# EAGLE schematic jr-support (EAGLE 8.1.0)
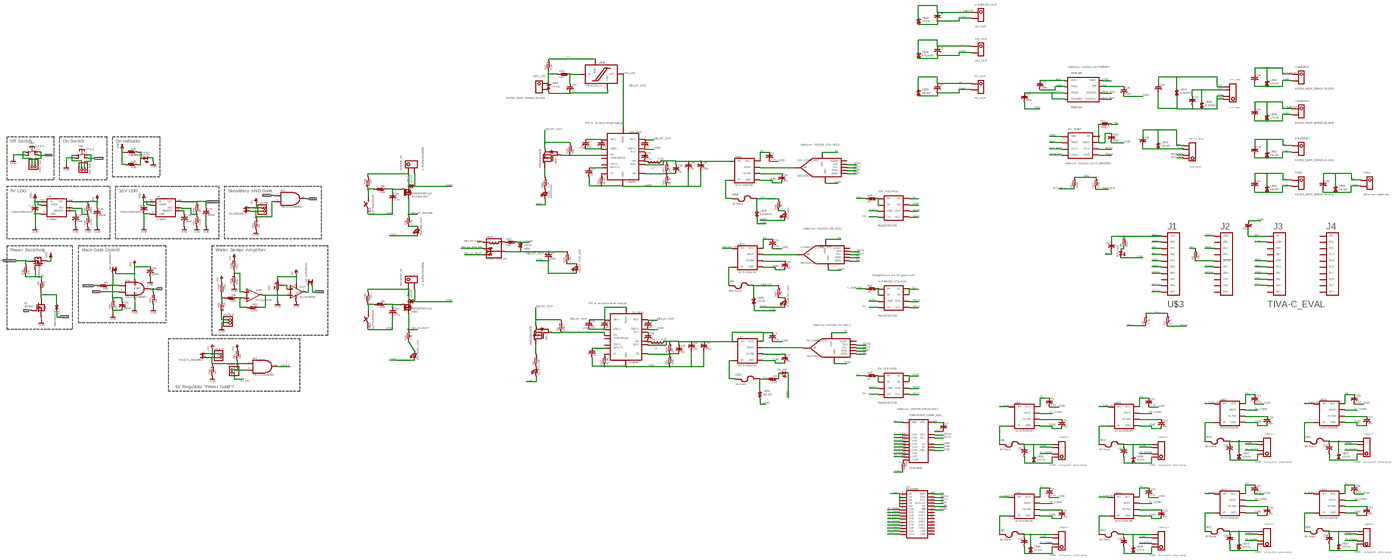
[diagram p0: schematic, sheet 1, overview]
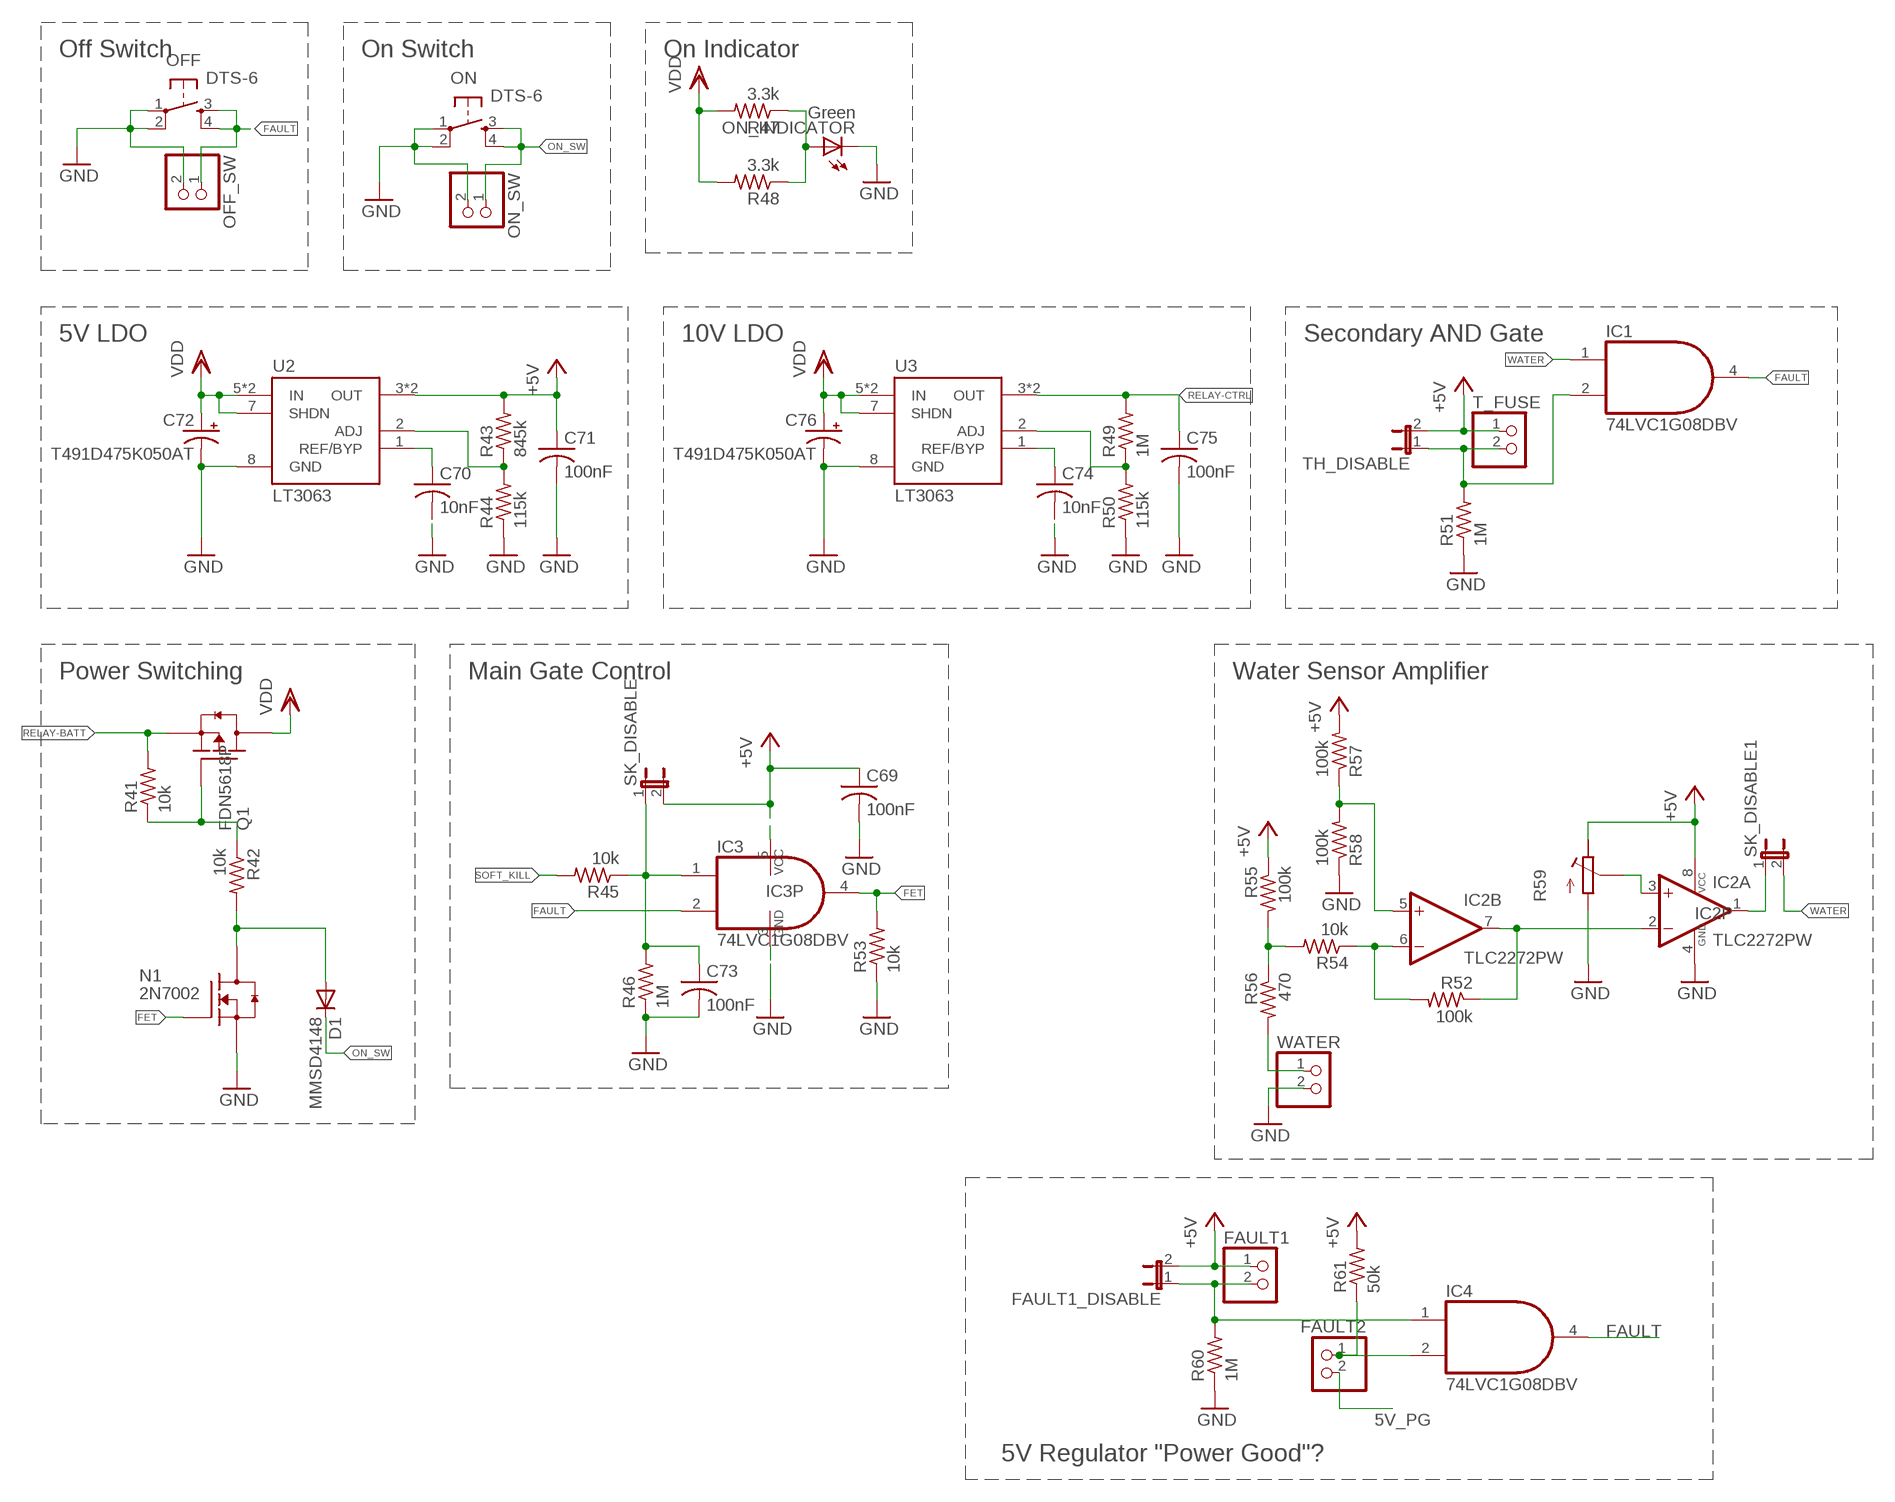
[diagram p1: schematic, sheet 1, part 1 of 4]
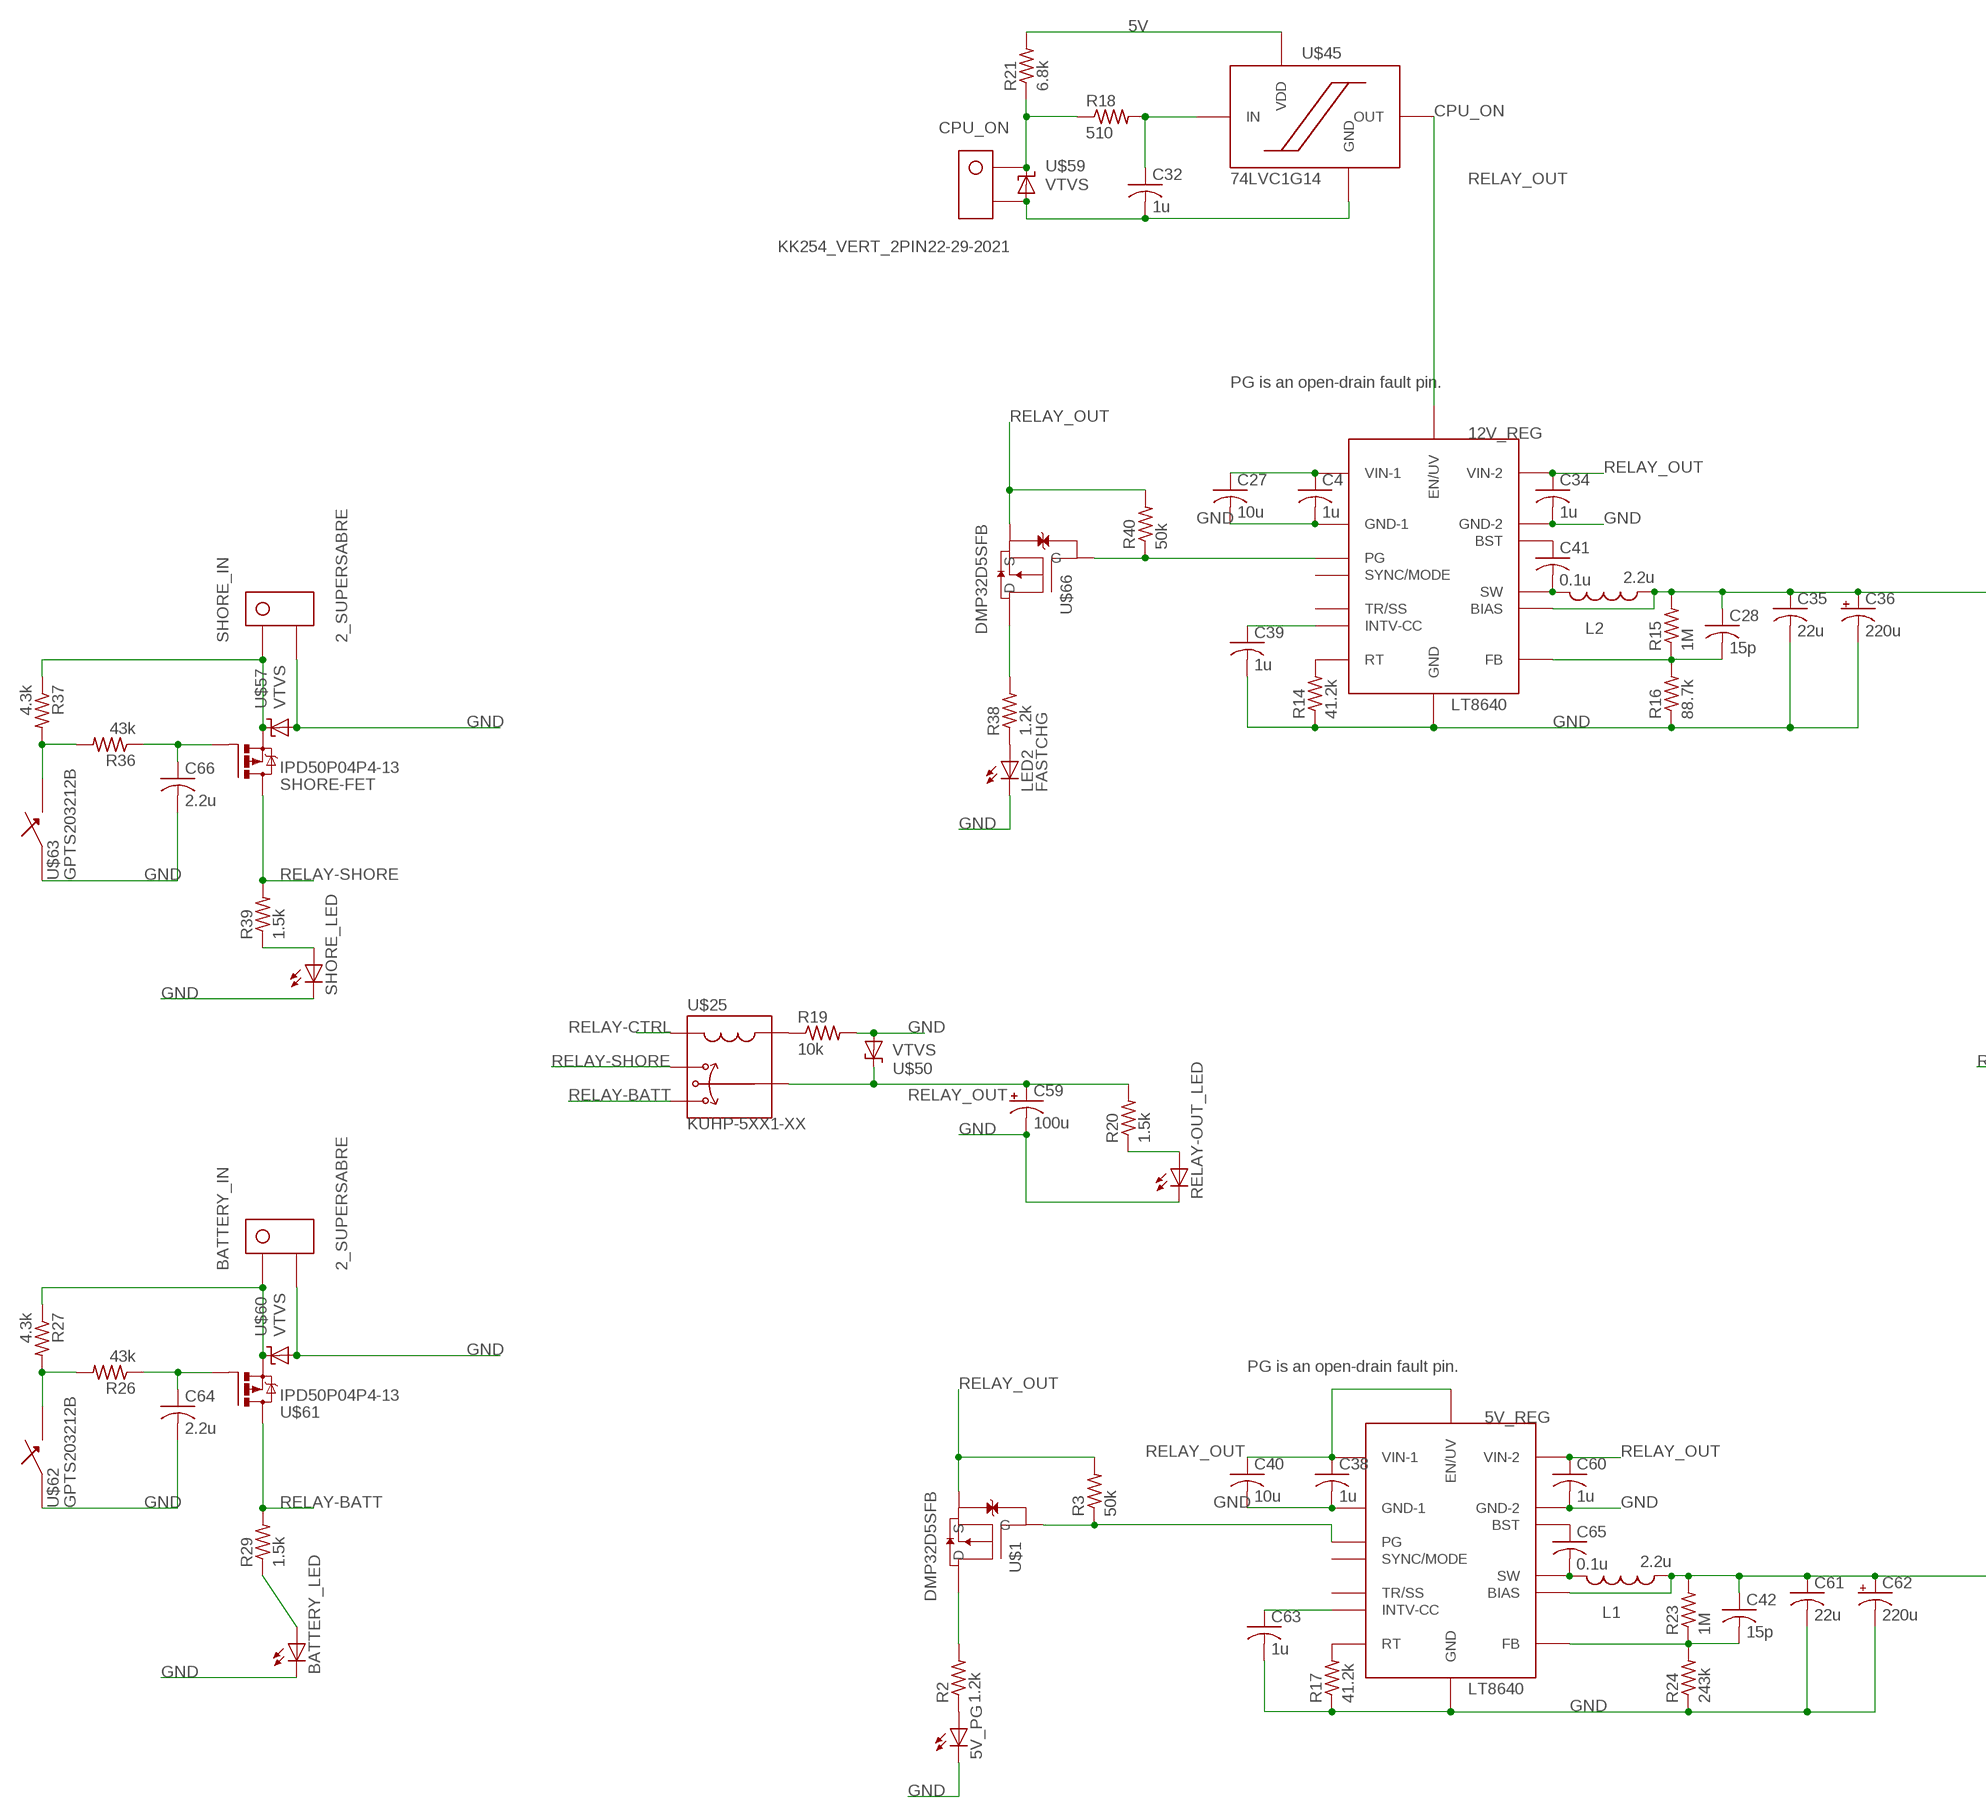
[diagram p2: schematic, sheet 1, part 2 of 4]
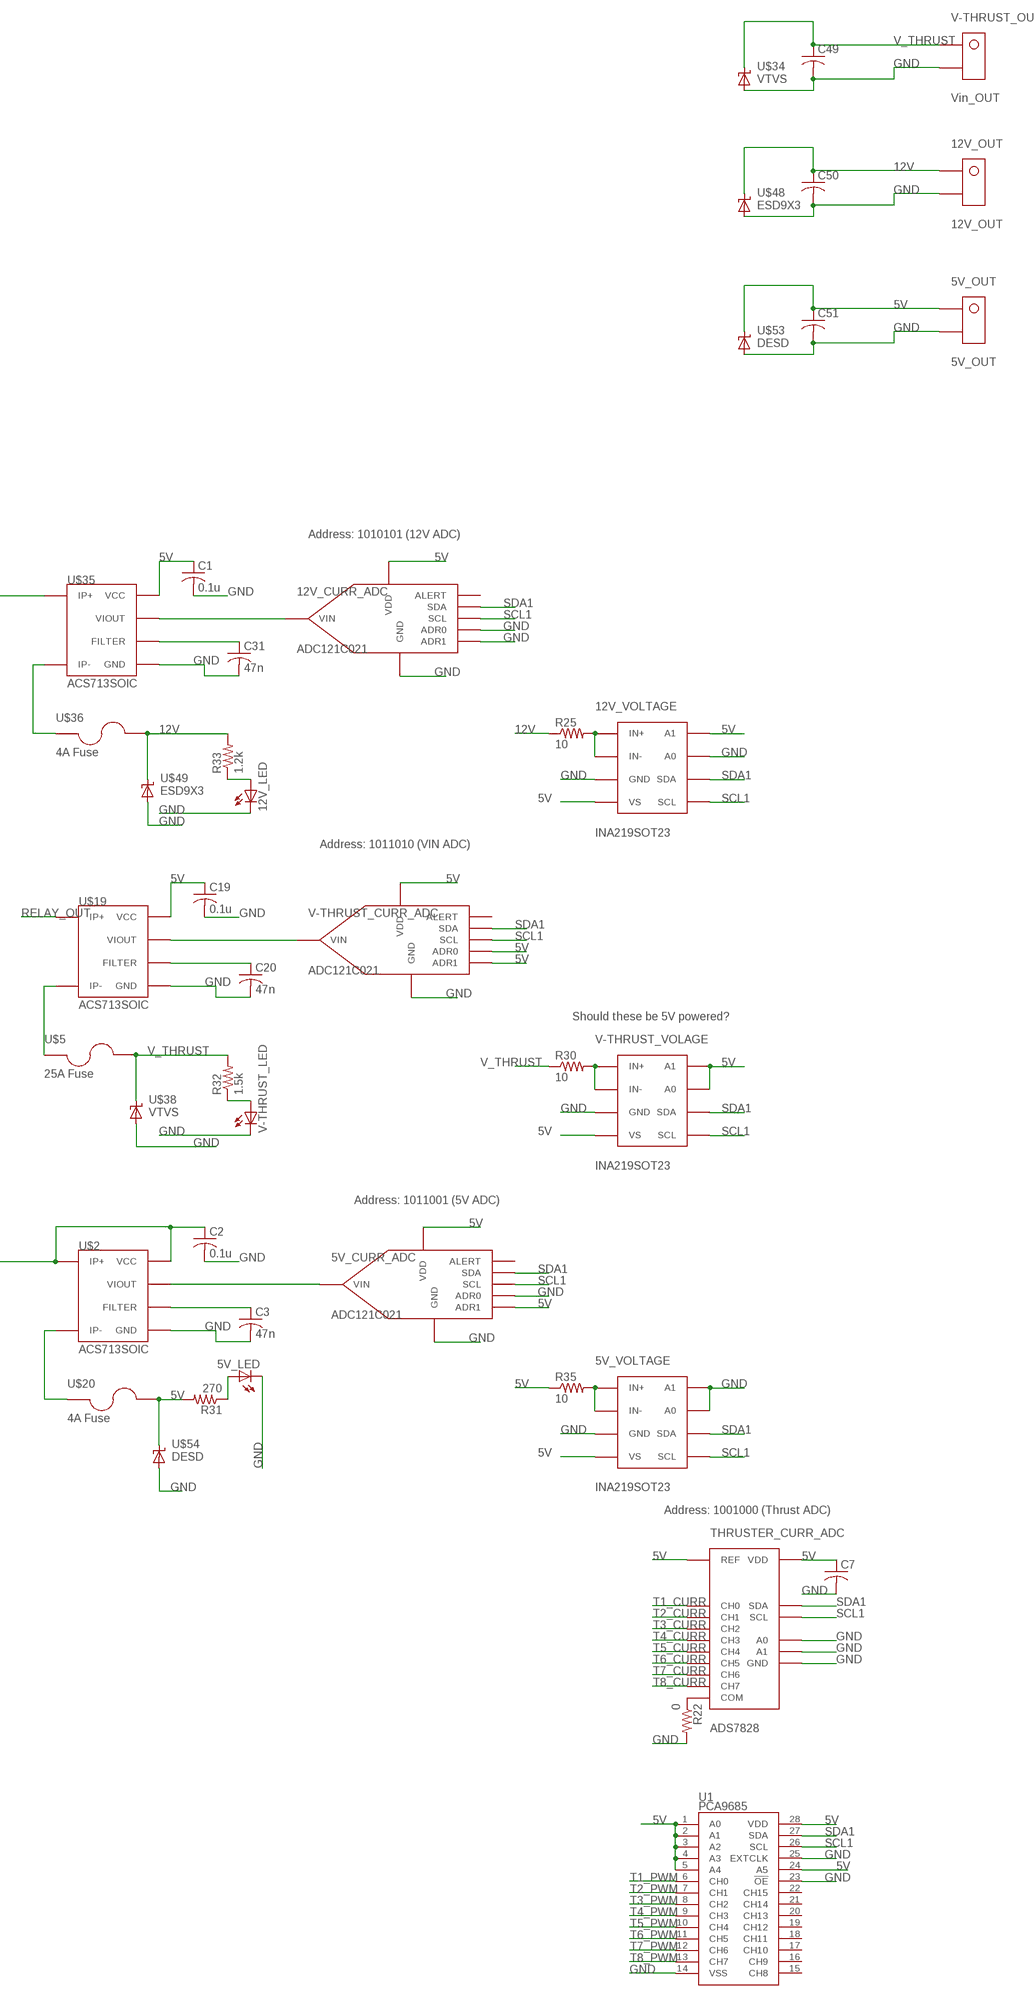
[diagram p3: schematic, sheet 1, part 3 of 4]
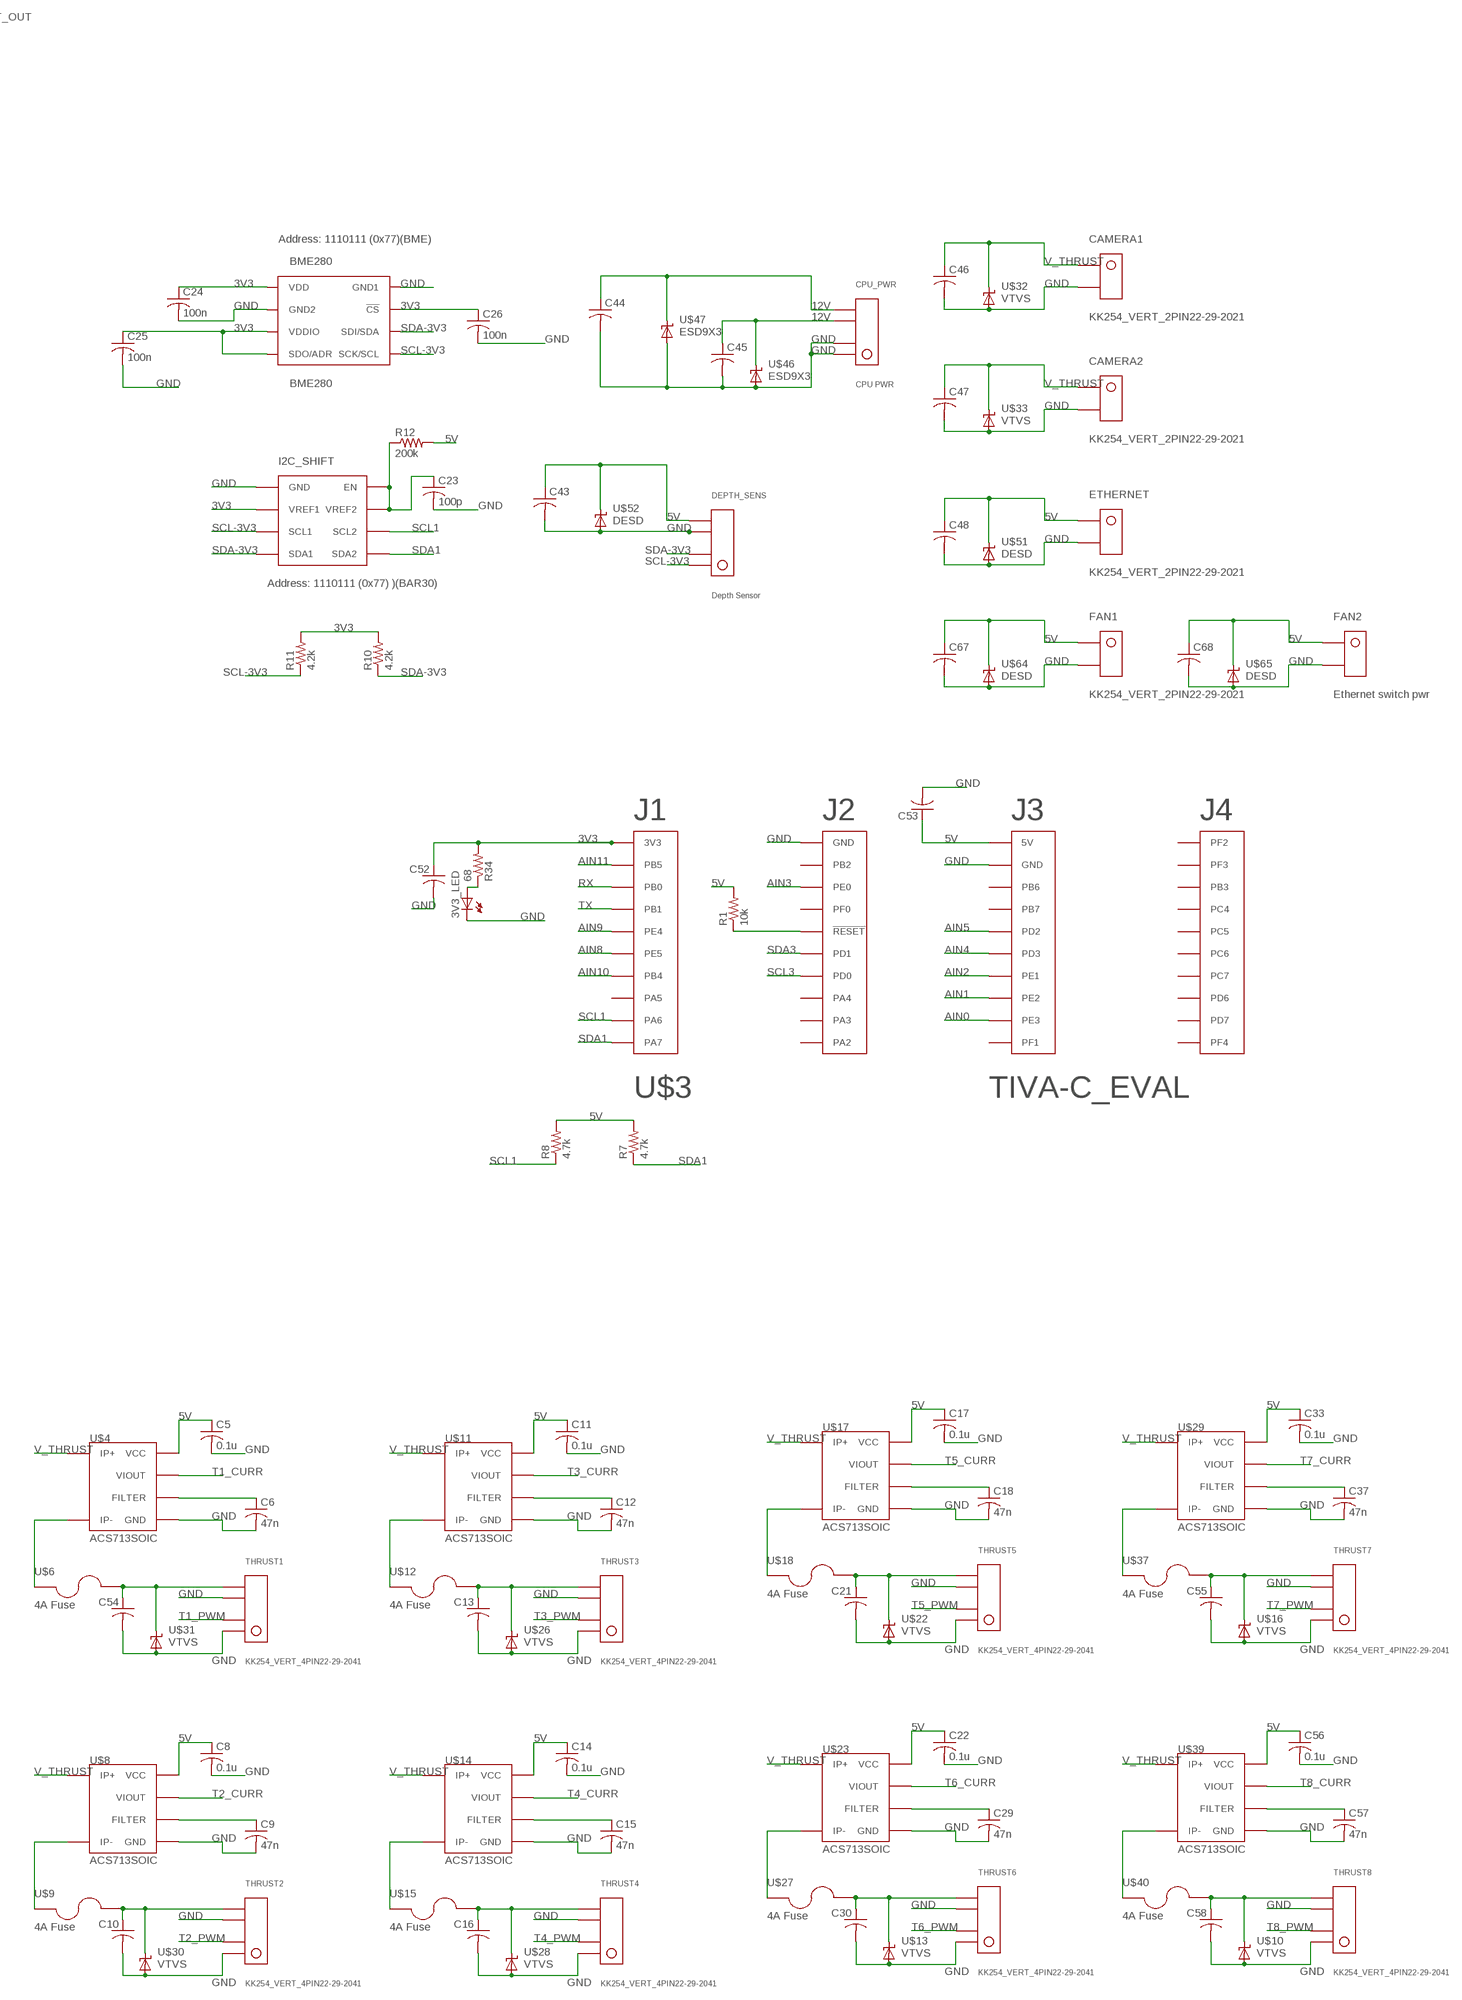
[diagram p4: schematic, sheet 1, part 4 of 4]

## Parts
3V3_LED  0805_LED  [0805]
5V_CURR_ADC  ADC121C021  [VSSOP-8]
5V_LED  0805_LED  [0805]
5V_OUT  5V_OUT  KK254_VERT_2PIN22-29-2021  [KK254_VERT_2PIN]
5V_PG  LEDCHIP-LED0805  [CHIP-LED0805]
5V_REG  LT8640  [QFN18-3X4]
5V_VOLTAGE  INA219SOT23  [SOT-23-8]
12V_CURR_ADC  ADC121C021  [VSSOP-8]
12V_LED  0805_LED  [0805]
12V_OUT  12V_OUT  KK254_VERT_2PIN22-29-2021  [KK254_VERT_2PIN]
12V_REG  LT8640  [QFN18-3X4]
12V_VOLTAGE  INA219SOT23  [SOT-23-8]
BATTERY_IN  2_SUPERSABRE  [SUPERSABRE_2CIRCUIT]
BATTERY_LED  0805_LED  [0805]
BME280  BME280  [BME280_LGA]
C1  0.1u  C-USC0805  [C0805]
C2  0.1u  C-USC0805  [C0805]
C3  47n  C-USC0805  [C0805]
C4  1u  C-USC0805  [C0805]
C5  0.1u  C-USC0805  [C0805]
C6  47n  C-USC0805  [C0805]
C7  C-USC0805  [C0805]
C8  0.1u  C-USC0805  [C0805]
C9  47n  C-USC0805  [C0805]
C10  C-USC0805  [C0805]
C11  0.1u  C-USC0805  [C0805]
C12  47n  C-USC0805  [C0805]
C13  C-USC0805  [C0805]
C14  0.1u  C-USC0805  [C0805]
C15  47n  C-USC0805  [C0805]
C16  C-USC0805  [C0805]
C17  0.1u  C-USC0805  [C0805]
C18  47n  C-USC0805  [C0805]
C19  0.1u  C-USC0805  [C0805]
C20  47n  C-USC0805  [C0805]
C21  C-USC0805  [C0805]
C22  0.1u  C-USC0805  [C0805]
C23  100p  C-USC0805  [C0805]
C24  100n  C-USC0805  [C0805]
C25  100n  C-USC0805  [C0805]
C26  100n  C-USC0805  [C0805]
C27  10u  C-USC0805  [C0805]
C28  15p  C-USC0805  [C0805]
C29  47n  C-USC0805  [C0805]
C30  C-USC0805  [C0805]
C31  47n  C-USC0805  [C0805]
C32  1u  C-USC0805  [C0805]
C33  0.1u  C-USC0805  [C0805]
C34  1u  C-USC0805  [C0805]
C35  22u  C-USC0805  [C0805]
C36  220u  CPOL-USC-F80  [C-F80]
C37  47n  C-USC0805  [C0805]
C38  1u  C-USC0805  [C0805]
C39  1u  C-USC0805  [C0805]
C40  10u  C-USC0805  [C0805]
C41  0.1u  C-USC0805  [C0805]
C42  15p  C-USC0805  [C0805]
C43  C-USC0805  [C0805]
C44  C-USC0805  [C0805]
C45  C-USC0805  [C0805]
C46  C-USC0805  [C0805]
C47  C-USC0805  [C0805]
C48  C-USC0805  [C0805]
C49  C-USC0805  [C0805]
C50  C-USC0805  [C0805]
C51  C-USC0805  [C0805]
C52  C-USC0805  [C0805]
C53  C-USC0805  [C0805]
C54  C-USC0805  [C0805]
C55  C-USC0805  [C0805]
C56  0.1u  C-USC0805  [C0805]
C57  47n  C-USC0805  [C0805]
C58  C-USC0805  [C0805]
C59  100u  CPOL-USE3.5-8  [E3,5-8]
C60  1u  C-USC0805  [C0805]
C61  22u  C-USC0805  [C0805]
C62  220u  CPOL-USC-F80  [C-F80]
C63  1u  C-USC0805  [C0805]
C64  2.2u  C-USC0805  [C0805]
C65  0.1u  C-USC0805  [C0805]
C66  2.2u  C-USC0805  [C0805]
C67  C-USC0805  [C0805]
C68  C-USC0805  [C0805]
C69  100nF  C-USC0805  [C0805]
C70  10nF  C-USC0805  [C0805]
C71  100nF  C-USC0805  [C0805]
C72  T491D475K050AT  CPOL-USCT7343  [CT7343]
C73  100nF  C-USC0805  [C0805]
C74  10nF  C-USC0805  [C0805]
C75  100nF  C-USC0805  [C0805]
C76  T491D475K050AT  CPOL-USCT7343  [CT7343]
CAMERA1  KK254_VERT_2PIN22-29-2021  [KK254_VERT_2PIN]
CAMERA2  KK254_VERT_2PIN22-29-2021  [KK254_VERT_2PIN]
CPU_ON  KK254_VERT_2PIN22-29-2021  [KK254_VERT_2PIN]
CPU_PWR  CPU PWR  KK254_VERT_4PIN22-29-2041  [KK254_VERT_4PIN]
D1  MMSD4148  DIODE-SOD123  [SOD123]
DEPTH_SENS  Depth Sensor  KK254_VERT_4PIN22-29-2041  [KK254_VERT_4PIN]
ETHERNET  KK254_VERT_2PIN22-29-2021  [KK254_VERT_2PIN]
FAN1  KK254_VERT_2PIN22-29-2021  [KK254_VERT_2PIN]
FAN2  Ethernet switch pwr  KK254_VERT_2PIN22-29-2021  [KK254_VERT_2PIN]
FAULT1  PINHD-1X2  [1X02]
FAULT1_DISABLE  JP1E  [JP1]
FAULT2  PINHD-1X2  [1X02]
I2C_SHIFT  PCA9306DCT  [SM8]
IC1  74LVC1G08DBV  [SOT23-5]
IC2  TLC2272PW  [TSSOP8]
IC3  74LVC1G08DBV  [SOT23-5]
IC4  74LVC1G08DBV  [SOT23-5]
L1  2.2u  L-USL0740  [L0740]
L2  2.2u  L-USL0740  [L0740]
LED2  FASTCHG  LEDCHIP-LED0805  [CHIP-LED0805]
N1  2N7002  [SOT23]
OFF  DTS-6  [DTS-6]
OFF_SW  PINHD-1X2  [1X02]
ON  DTS-6  [DTS-6]
ON_INDICATOR  Green  LEDCHIP-LED0805  [CHIP-LED0805]
ON_SW  PINHD-1X2  [1X02]
Q1  FDN5618P  [SOT23]
R1  10k  R-US_R0805  [R0805]
R2  1.2k  R-US_R0805  [R0805]
R3  50k  R-US_R0805  [R0805]
R7  4.7k  R-US_R0805  [R0805]
R8  4.7k  R-US_R0805  [R0805]
R10  4.2k  R-US_R0805  [R0805]
R11  4.2k  R-US_R0805  [R0805]
R12  200k  R-US_R0805  [R0805]
R14  41.2k  R-US_R0805  [R0805]
R15  1M  R-US_R0805  [R0805]
R16  88.7k  R-US_R0805  [R0805]
R17  41.2k  R-US_R0805  [R0805]
R18  510  R-US_R0805  [R0805]
R19  10k  R-US_R0805  [R0805]
R20  1.5k  R-US_R0805  [R0805]
R21  6.8k  R-US_R0805  [R0805]
R22  0  R-US_R0805  [R0805]
R23  1M  R-US_R0805  [R0805]
R24  243k  R-US_R0805  [R0805]
R25  10  R-US_R0805  [R0805]
R26  43k  R-US_R0805  [R0805]
R27  4.3k  R-US_R0805  [R0805]
R29  1.5k  R-US_R0805  [R0805]
R30  10  R-US_R0805  [R0805]
R31  270  R-US_R0805  [R0805]
R32  1.5k  R-US_R0805  [R0805]
R33  1.2k  R-US_R0805  [R0805]
R34  68  R-US_R0805  [R0805]
R35  10  R-US_R0805  [R0805]
R36  43k  R-US_R0805  [R0805]
R37  4.3k  R-US_R0805  [R0805]
R38  1.2k  R-US_R0805  [R0805]
R39  1.5k  R-US_R0805  [R0805]
R40  50k  R-US_R0805  [R0805]
R41  10k  R-US_R0805  [R0805]
R42  10k  R-US_R0805  [R0805]
R43  845k  R-US_R0805  [R0805]
R44  115k  R-US_R0805  [R0805]
R45  10k  R-US_R0805  [R0805]
R46  1M  R-US_R0805  [R0805]
R47  3.3k  R-US_R0805  [R0805]
R48  3.3k  R-US_R0805  [R0805]
R49  1M  R-US_R0805  [R0805]
R50  115k  R-US_R0805  [R0805]
R51  1M  R-US_R0805  [R0805]
R52  100k  R-US_R0805  [R0805]
R53  10k  R-US_R0805  [R0805]
R54  10k  R-US_R0805  [R0805]
R55  100k  R-US_R0805  [R0805]
R56  470  R-US_R0805  [R0805]
R57  100k  R-US_R0805  [R0805]
R58  100k  R-US_R0805  [R0805]
R59  R-TRIMM3314J  [RTRIM3314J]
R60  1M  R-US_R0805  [R0805]
R61  50k  R-US_R0805  [R0805]
RELAY-OUT_LED  0805_LED  [0805]
SHORE-FET  IPD50P04P4-13  [TO252-3]
SHORE_IN  2_SUPERSABRE  [SUPERSABRE_2CIRCUIT]
SHORE_LED  0805_LED  [0805]
SK_DISABLE  JP1E  [JP1]
SK_DISABLE1  JP1E  [JP1]
T_FUSE  PINHD-1X2  [1X02]
TH_DISABLE  JP1E  [JP1]
THRUST1  KK254_VERT_4PIN22-29-2041  [KK254_VERT_4PIN]
THRUST2  KK254_VERT_4PIN22-29-2041  [KK254_VERT_4PIN]
THRUST3  KK254_VERT_4PIN22-29-2041  [KK254_VERT_4PIN]
THRUST4  KK254_VERT_4PIN22-29-2041  [KK254_VERT_4PIN]
THRUST5  KK254_VERT_4PIN22-29-2041  [KK254_VERT_4PIN]
THRUST6  KK254_VERT_4PIN22-29-2041  [KK254_VERT_4PIN]
THRUST7  KK254_VERT_4PIN22-29-2041  [KK254_VERT_4PIN]
THRUST8  KK254_VERT_4PIN22-29-2041  [KK254_VERT_4PIN]
THRUSTER_CURR_ADC  ADS7828  [TSSOP16]
U1  PCA9685  [TSSOP-28_4MM]
U2  LT3063  [MSOP8]
U3  LT3063  [MSOP8]
U$1  DMP32D5SFB  [AP02002]
U$2  ACS713SOIC  [ACS713-SOIC]
U$3  TIVA-C_EVAL  [TIVA-C_EVAL]
U$4  ACS713SOIC  [ACS713-SOIC]
U$5  25A Fuse  BOWED-1.25"-FUSECLIPS  [1.25"_FUSECLIPS]
U$6  4A Fuse  154-OMNI_BLOK  [154-OMNI-BLOK]
U$8  ACS713SOIC  [ACS713-SOIC]
U$9  4A Fuse  154-OMNI_BLOK  [154-OMNI-BLOK]
U$10  VTVS  [DO-219AB]
U$11  ACS713SOIC  [ACS713-SOIC]
U$12  4A Fuse  154-OMNI_BLOK  [154-OMNI-BLOK]
U$13  VTVS  [DO-219AB]
U$14  ACS713SOIC  [ACS713-SOIC]
U$15  4A Fuse  154-OMNI_BLOK  [154-OMNI-BLOK]
U$16  VTVS  [DO-219AB]
U$17  ACS713SOIC  [ACS713-SOIC]
U$18  4A Fuse  154-OMNI_BLOK  [154-OMNI-BLOK]
U$19  ACS713SOIC  [ACS713-SOIC]
U$20  4A Fuse  154-OMNI_BLOK  [154-OMNI-BLOK]
U$22  VTVS  [DO-219AB]
U$23  ACS713SOIC  [ACS713-SOIC]
U$25  KUHP-5XX1-XX  [KUHP_6.35MM-QUICK-CONNECT]
U$26  VTVS  [DO-219AB]
U$27  4A Fuse  154-OMNI_BLOK  [154-OMNI-BLOK]
U$28  VTVS  [DO-219AB]
U$29  ACS713SOIC  [ACS713-SOIC]
U$30  VTVS  [DO-219AB]
U$31  VTVS  [DO-219AB]
U$32  VTVS  [DO-219AB]
U$33  VTVS  [DO-219AB]
U$34  VTVS  [DO-219AB]
U$35  ACS713SOIC  [ACS713-SOIC]
U$36  4A Fuse  154-OMNI_BLOK  [154-OMNI-BLOK]
U$37  4A Fuse  154-OMNI_BLOK  [154-OMNI-BLOK]
U$38  VTVS  [DO-219AB]
U$39  ACS713SOIC  [ACS713-SOIC]
U$40  4A Fuse  154-OMNI_BLOK  [154-OMNI-BLOK]
U$45  74LVC1G14  [TSSOP5]
U$46  ESD9X3  [SOD-923_SMD]
U$47  ESD9X3  [SOD-923_SMD]
U$48  ESD9X3  [SOD-923_SMD]
U$49  ESD9X3  [SOD-923_SMD]
U$50  VTVS  [DO-219AB]
U$51  DESD  [X1-DFN1006-2]
U$52  DESD  [X1-DFN1006-2]
U$53  DESD  [X1-DFN1006-2]
U$54  DESD  [X1-DFN1006-2]
U$57  VTVS  [DO-219AB]
U$59  VTVS  [DO-219AB]
U$60  VTVS  [DO-219AB]
U$61  IPD50P04P4-13  [TO252-3]
U$62  GPTS203212B  [GPTS203211B]
U$63  GPTS203212B  [GPTS203211B]
U$64  DESD  [X1-DFN1006-2]
U$65  DESD  [X1-DFN1006-2]
U$66  DMP32D5SFB  [AP02002]
V-THRUST_CURR_ADC  ADC121C021  [VSSOP-8]
V-THRUST_LED  0805_LED  [0805]
V-THRUST_OUT  Vin_OUT  KK254_VERT_2PIN22-29-2021  [KK254_VERT_2PIN]
V-THRUST_VOLAGE  INA219SOT23  [SOT-23-8]
WATER  PINHD-1X2  [1X02]

## Nets
3V3: BME280.P$2(!CS) BME280.P$5(SDO/ADR) BME280.P$6(VDDIO) BME280.P$8(VDD) C24.1 C25.1 C26.1 C52.1 I2C_SHIFT.P$2(VREF1) R10.2 R11.2 R34.2 U$3.1-1(3V3)
5V: 5V_CURR_ADC.P$5(VDD) 5V_CURR_ADC.P$6(ADR1) 5V_OUT.P$1 5V_VOLTAGE.P$4(VS) 12V_CURR_ADC.P$5(VDD) 12V_VOLTAGE.P$4(VS) 12V_VOLTAGE.P$8(A1) C1.1 C5.1 C7.1 C8.1 C11.1 C14.1 C17.1 C19.1 C22.1 C33.1 C43.1 C48.1 C51.1 C53.1 C56.1 C67.1 C68.1 DEPTH_SENS.P$4 ETHERNET.P$1 FAN1.P$1 FAN2.P$1 R1.2 R7.2 R8.2 R12.2 R21.2 R31.2 R35.1 THRUSTER_CURR_ADC.10(REF) THRUSTER_CURR_ADC.16(VDD) U1.1(A0) U1.2(A1) U1.3(A2) U1.4(A3) U1.5(A4) U1.24(A5) U1.28(VDD) U$3.3-1(5V) U$4.P$8(VCC) U$8.P$8(VCC) U$11.P$8(VCC) U$14.P$8(VCC) U$17.P$8(VCC) U$19.P$8(VCC) U$20.P$2 U$23.P$8(VCC) U$29.P$8(VCC) U$35.P$8(VCC) U$39.P$8(VCC) U$45.P$5(VDD) U$51.P$2(C) U$52.P$2(C) U$53.P$2(C) U$54.P$2(C) U$64.P$2(C) U$65.P$2(C) V-THRUST_CURR_ADC.P$3(ADR0) V-THRUST_CURR_ADC.P$5(VDD) V-THRUST_CURR_ADC.P$6(ADR1) V-THRUST_VOLAGE.P$4(VS) V-THRUST_VOLAGE.P$7(A0) V-THRUST_VOLAGE.P$8(A1)
5V_PG: FAULT2.2
12V: 12V_OUT.P$1 C44.1 C45.1 C50.1 CPU_PWR.P$3 CPU_PWR.P$4 R25.1 R33.2 U$36.P$2 U$46.P$1(C) U$47.P$1(C) U$48.P$1(C) U$49.P$1(C)
+5V: C69.1 C71.1 FAULT1.1 FAULT1_DISABLE.2 IC2.8(P:VCC) IC3.5(VCC) R43.2 R55.1 R57.2 R59.3(A) R61.2 SK_DISABLE.2 T_FUSE.1 TH_DISABLE.2 U2.3(OUT) U2.4(OUT)
AIN0: U$3.3-9(PE3)
AIN1: U$3.3-8(PE2)
AIN2: U$3.3-7(PE1)
AIN3: U$3.2-3(PE0)
AIN4: U$3.3-6(PD3)
AIN5: U$3.3-5(PD2)
AIN8: U$3.1-6(PE5)
AIN9: U$3.1-5(PE4)
AIN10: U$3.1-7(PB4)
AIN11: U$3.1-2(PB5)
CPU_ON: 12V_REG.14(EN/UV) U$45.P$4(OUT)
FAULT: IC1.4(O) IC3.2(I1) IC4.4(O) OFF.3 OFF.4 OFF_SW.1
FET: IC3.4(O) N1.1(G) R53.2
GND: 3V3_LED.P$2(C) 5V_CURR_ADC.P$3(ADR0) 5V_CURR_ADC.P$7(GND) 5V_LED.P$2(C) 5V_OUT.P$2 5V_PG.C 5V_REG.6(GND-1) 5V_REG.7(GND-1) 5V_REG.10(GND-2) 5V_REG.11(GND-2) 5V_REG.18(GND) 5V_VOLTAGE.P$3(GND) 5V_VOLTAGE.P$7(A0) 5V_VOLTAGE.P$8(A1) 12V_CURR_ADC.P$3(ADR0) 12V_CURR_ADC.P$6(ADR1) 12V_CURR_ADC.P$7(GND) 12V_LED.P$2(C) 12V_OUT.P$2 12V_REG.6(GND-1) 12V_REG.7(GND-1) 12V_REG.10(GND-2) 12V_REG.11(GND-2) 12V_REG.18(GND) 12V_VOLTAGE.P$3(GND) 12V_VOLTAGE.P$7(A0) BATTERY_IN.P$2 BATTERY_LED.P$2(C) BME280.P$1(GND1) BME280.P$7(GND2) C1.2 C2.2 C3.2 C4.2 C5.2 C6.2 C7.2 C8.2 C9.2 C10.2 C11.2 C12.2 C13.2 C14.2 C15.2 C16.2 C17.2 C18.2 C19.2 C20.2 C21.2 C22.2 C23.2 C24.2 C25.2 C26.2 C27.2 C29.2 C30.2 C31.2 C33.2 C34.2 C35.2 C36.P$2(-) C37.2 C38.2 C39.2 C40.2 C43.2 C44.2 C45.2 C46.2 C47.2 C48.2 C49.2 C50.2 C51.2 C52.2 C53.2 C54.2 C55.2 C56.2 C57.2 C58.2 C59.- C60.2 C61.2 C62.P$2(-) C63.2 C64.2 C66.2 C67.2 C68.2 C69.2 C70.2 C71.2 C72.- C73.2 C74.2 C75.2 C76.- CAMERA1.P$2 CAMERA2.P$2 CPU_PWR.P$1 CPU_PWR.P$2 DEPTH_SENS.P$3 ETHERNET.P$2 FAN1.P$2 FAN2.P$2 I2C_SHIFT.P$1(GND) IC2.4(P:GND) IC3.3(GND) LED2.C N1.2(S) OFF.1 OFF.2 OFF_SW.2 ON.1 ON.2 ON_INDICATOR.C ON_SW.2 R14.1 R16.1 R17.1 R19.2 R22.2 R24.1 R44.1 R46.1 R50.1 R51.1 R53.1 R58.1 R59.1(E) R60.1 RELAY-OUT_LED.P$2(C) SHORE_IN.P$2 SHORE_LED.P$2(C) THRUST1.P$1 THRUST1.P$3 THRUST2.P$1 THRUST2.P$3 THRUST3.P$1 THRUST3.P$3 THRUST4.P$1 THRUST4.P$3 THRUST5.P$1 THRUST5.P$3 THRUST6.P$1 THRUST6.P$3 THRUST7.P$1 THRUST7.P$3 THRUST8.P$1 THRUST8.P$3 THRUSTER_CURR_ADC.9(GND) THRUSTER_CURR_ADC.12(A0) THRUSTER_CURR_ADC.13(A1) U1.14(VSS) U1.23(!OE) U1.25(EXTCLK) U2.8(GND) U3.8(GND) U$2.P$5(GND) U$3.2-1(GND) U$3.3-2(GND) U$4.P$5(GND) U$8.P$5(GND) U$10.P$1(A) U$11.P$5(GND) U$13.P$1(A) U$14.P$5(GND) U$16.P$1(A) U$17.P$5(GND) U$19.P$5(GND) U$22.P$1(A) U$23.P$5(GND) U$26.P$1(A) U$28.P$1(A) U$29.P$5(GND) U$30.P$1(A) U$31.P$1(A) U$32.P$1(A) U$33.P$1(A) U$34.P$1(A) U$35.P$5(GND) U$38.P$1(A) U$39.P$5(GND) U$46.P$2(A) U$47.P$2(A) U$48.P$2(A) U$49.P$2(A) U$50.P$1(A) U$51.P$1(A) U$52.P$1(A) U$53.P$1(A) U$54.P$1(A) U$57.P$1(A) U$60.P$1(A) U$62.P$1 U$63.P$1 U$64.P$1(A) U$65.P$1(A) V-THRUST_CURR_ADC.P$7(GND) V-THRUST_LED.P$2(C) V-THRUST_OUT.P$2 V-THRUST_VOLAGE.P$3(GND) WATER.2
N$1: 12V_REG.15(RT) R14.2
N$2: R1.1 U$3.2-5(!RESET!)
N$3: FAULT2.1 IC4.2(I1) R61.1
N$4: 5V_PG.A R2.1
N$5: R2.2 U$1.P$3(D)
N$6: 5V_REG.19(PG) R3.1 U$1.P$2(G)
N$7: 12V_REG.1(BIAS) C28.1 C35.1 C36.P$1(+) L2.P$2 R15.2 U$35.P$1(IP+) U$35.P$2(IP+)
N$8: 5V_REG.15(RT) R17.2
N$11: C3.1 U$2.P$6(FILTER)
N$12: C9.1 U$8.P$6(FILTER)
N$13: C6.1 U$4.P$6(FILTER)
N$14: C54.1 THRUST1.P$4 U$6.P$2 U$31.P$2(C)
N$15: U$4.P$3(IP-) U$4.P$4(IP-) U$6.P$1
N$16: C10.1 THRUST2.P$4 U$9.P$2 U$30.P$2(C)
N$17: U$8.P$3(IP-) U$8.P$4(IP-) U$9.P$1
N$18: C12.1 U$11.P$6(FILTER)
N$19: C13.1 THRUST3.P$4 U$12.P$2 U$26.P$2(C)
N$20: U$11.P$3(IP-) U$11.P$4(IP-) U$12.P$1
N$21: C15.1 U$14.P$6(FILTER)
N$22: C16.1 THRUST4.P$4 U$15.P$2 U$28.P$2(C)
N$23: R22.1 THRUSTER_CURR_ADC.11(COM)
N$24: U$14.P$3(IP-) U$14.P$4(IP-) U$15.P$1
N$25: C18.1 U$17.P$6(FILTER)
N$26: C21.1 THRUST5.P$4 U$18.P$2 U$22.P$2(C)
N$27: U$17.P$3(IP-) U$17.P$4(IP-) U$18.P$1
N$28: C29.1 U$23.P$6(FILTER)
N$29: C30.1 THRUST6.P$4 U$13.P$2(C) U$27.P$2
N$30: U$23.P$3(IP-) U$23.P$4(IP-) U$27.P$1
N$31: C37.1 U$29.P$6(FILTER)
N$32: 12V_REG.8(SW) 12V_REG.9(SW) 12V_REG.21(SW) 12V_REG.22(SW) C41.2 L2.P$1
N$33: C20.1 U$19.P$6(FILTER)
N$34: U$5.P$1 U$5.P$2 U$19.P$3(IP-) U$19.P$4(IP-)
N$35: R19.1 U$25.AA(A) U$25.AB(A)
N$36: C55.1 THRUST7.P$4 U$16.P$2(C) U$37.P$2
N$37: U$29.P$3(IP-) U$29.P$4(IP-) U$37.P$1
N$38: C57.1 U$39.P$6(FILTER)
N$39: C58.1 THRUST8.P$4 U$10.P$2(C) U$40.P$2
N$40: 5V_REG.8(SW) 5V_REG.9(SW) 5V_REG.21(SW) 5V_REG.22(SW) C65.2 L1.P$1
N$41: C23.1 I2C_SHIFT.P$7(VREF2) I2C_SHIFT.P$8(EN) R12.1
N$42: 5V_REG.20(FB) C42.2 R23.1 R24.2
N$43: 5V_REG.3(BST) C65.1
N$44: 12V_REG.20(FB) C28.2 R15.1 R16.2
N$45: 12V_REG.3(BST) C41.1
N$46: Q1.1(G) R41.1 R42.1
N$47: U$39.P$3(IP-) U$39.P$4(IP-) U$40.P$1
N$48: 5V_REG.2(INTV-CC) C63.1
N$49: 12V_VOLTAGE.P$1(IN+) 12V_VOLTAGE.P$2(IN-) R25.2
N$50: R37.1 SHORE-FET.TAB(D) SHORE_IN.P$1 U$57.P$2(C)
N$51: C32.2 CPU_ON.P$2 U$45.P$3(GND) U$59.P$1(A)
N$52: C31.1 U$35.P$6(FILTER)
N$53: U$19.P$7(VIOUT) V-THRUST_CURR_ADC.P$4(VIN)
N$54: 12V_REG.2(INTV-CC) C39.1
N$55: U$2.P$3(IP-) U$2.P$4(IP-) U$20.P$1
N$56: U$35.P$3(IP-) U$35.P$4(IP-) U$36.P$1
N$57: 5V_CURR_ADC.P$4(VIN) U$2.P$7(VIOUT)
N$58: R30.2 V-THRUST_VOLAGE.P$1(IN+) V-THRUST_VOLAGE.P$2(IN-)
N$59: C32.1 R18.2 U$45.P$2(IN)
N$60: 12V_CURR_ADC.P$4(VIN) U$35.P$7(VIOUT)
N$61: CPU_ON.P$1 R18.1 R21.1 U$59.P$2(C)
N$62: C66.1 R36.1 SHORE-FET.1(G)
N$63: R36.2 R37.2 U$63.P$2
N$64: BATTERY_IN.P$1 R27.1 U$60.P$2(C) U$61.TAB(D)
N$65: C64.1 R26.1 U$61.1(G)
N$66: R26.2 R27.2 U$62.P$2
N$68: R20.1 RELAY-OUT_LED.P$1(A)
N$69: BATTERY_LED.P$1(A) R29.1
N$71: 5V_LED.P$1(A) R31.1
N$72: R32.1 V-THRUST_LED.P$1(A)
N$73: 12V_LED.P$1(A) R33.1
N$74: 3V3_LED.P$1(A) R34.1
N$75: R39.1 SHORE_LED.P$1(A)
N$76: FAULT1.2 FAULT1_DISABLE.1 IC4.1(I0) R60.2
N$77: 5V_VOLTAGE.P$1(IN+) 5V_VOLTAGE.P$2(IN-) R35.2
N$78: LED2.A R38.1
N$79: R38.2 U$66.P$3(D)
N$80: 12V_REG.19(PG) R40.1 U$66.P$2(G)
N$81: D1.A N1.3(D) R42.2
N$82: R43.1 R44.2 U2.2(ADJ)
N$83: C70.1 U2.1(REF/BYP)
N$84: ON_INDICATOR.A R47.1 R48.1
N$85: R49.1 R50.2 U3.2(ADJ)
N$86: C74.1 U3.1(REF/BYP)
N$87: IC1.2(I1) R51.2 T_FUSE.2 TH_DISABLE.1
N$88: IC2.2(A:-IN) IC2.7(B:OUT) R52.1
N$89: IC2.6(B:-IN) R52.2 R54.1
N$90: IC2.5(B:+IN) R57.1 R58.2
N$91: R54.2 R55.2 R56.1
N$92: R56.2 WATER.1
N$93: IC2.3(A:+IN) R59.2(S)
N$94: IC2.1(A:OUT) SK_DISABLE1.1
ON_SW: D1.C ON.3 ON.4 ON_SW.1
RELAY-BATT: Q1.2(S) R29.2 R41.2 U$25.5A U$25.5B U$61.3(S)
RELAY-CTRL: C75.1 R49.2 U3.3(OUT) U3.4(OUT) U$25.BA(B) U$25.BB(B)
RELAY-SHORE: R39.2 SHORE-FET.3(S) U$25.2A U$25.2B
RELAY_OUT: 5V_REG.4(VIN-1) 5V_REG.13(VIN-2) 5V_REG.14(EN/UV) 12V_REG.4(VIN-1) 12V_REG.13(VIN-2) C4.1 C27.1 C34.1 C38.1 C40.1 C59.+ C60.1 R3.2 R20.2 R40.2 U$1.P$1(S) U$19.P$1(IP+) U$19.P$2(IP+) U$25.7A U$25.7B U$50.P$2(C) U$66.P$1(S)
RX: U$3.1-3(PB0)
SCL1: 5V_CURR_ADC.P$1(SCL) 5V_VOLTAGE.P$5(SCL) 12V_CURR_ADC.P$1(SCL) 12V_VOLTAGE.P$5(SCL) I2C_SHIFT.P$6(SCL2) R8.1 THRUSTER_CURR_ADC.14(SCL) U1.26(SCL) U$3.1-9(PA6) V-THRUST_CURR_ADC.P$1(SCL) V-THRUST_VOLAGE.P$5(SCL)
SCL3: U$3.2-7(PD0)
SCL-3V3: BME280.P$4(SCK/SCL) DEPTH_SENS.P$1 I2C_SHIFT.P$3(SCL1) R11.1
SDA1: 5V_CURR_ADC.P$8(SDA) 5V_VOLTAGE.P$6(SDA) 12V_CURR_ADC.P$8(SDA) 12V_VOLTAGE.P$6(SDA) I2C_SHIFT.P$5(SDA2) R7.1 THRUSTER_CURR_ADC.15(SDA) U1.27(SDA) U$3.1-10(PA7) V-THRUST_CURR_ADC.P$8(SDA) V-THRUST_VOLAGE.P$6(SDA)
SDA3: U$3.2-6(PD1)
SDA-3V3: BME280.P$3(SDI/SDA) DEPTH_SENS.P$2 I2C_SHIFT.P$4(SDA1) R10.1
SK: C73.1 IC3.1(I0) R45.1 R46.2 SK_DISABLE.1
SOFT_KILL: R45.2
SW-5V: 5V_REG.1(BIAS) C2.1 C42.1 C61.1 C62.P$1(+) L1.P$2 R23.2 U$2.P$1(IP+) U$2.P$2(IP+) U$2.P$8(VCC)
T1_CURR: THRUSTER_CURR_ADC.1(CH0) U$4.P$7(VIOUT)
T1_PWM: THRUST1.P$2 U1.6(CH0)
T2_CURR: THRUSTER_CURR_ADC.2(CH1) U$8.P$7(VIOUT)
T2_PWM: THRUST2.P$2 U1.7(CH1)
T3_CURR: THRUSTER_CURR_ADC.3(CH2) U$11.P$7(VIOUT)
T3_PWM: THRUST3.P$2 U1.8(CH2)
T4_CURR: THRUSTER_CURR_ADC.4(CH3) U$14.P$7(VIOUT)
T4_PWM: THRUST4.P$2 U1.9(CH3)
T5_CURR: THRUSTER_CURR_ADC.5(CH4) U$17.P$7(VIOUT)
T5_PWM: THRUST5.P$2 U1.10(CH4)
T6_CURR: THRUSTER_CURR_ADC.6(CH5) U$23.P$7(VIOUT)
T6_PWM: THRUST6.P$2 U1.11(CH5)
T7_CURR: THRUSTER_CURR_ADC.7(CH6) U$29.P$7(VIOUT)
T7_PWM: THRUST7.P$2 U1.12(CH6)
T8_CURR: THRUSTER_CURR_ADC.8(CH7) U$39.P$7(VIOUT)
T8_PWM: THRUST8.P$2 U1.13(CH7)
TX: U$3.1-4(PB1)
V_THRUST: C46.1 C47.1 C49.1 CAMERA1.P$1 CAMERA2.P$1 R30.1 R32.2 U$4.P$1(IP+) U$4.P$2(IP+) U$5.P$3 U$5.P$4 U$8.P$1(IP+) U$8.P$2(IP+) U$11.P$1(IP+) U$11.P$2(IP+) U$14.P$1(IP+) U$14.P$2(IP+) U$17.P$1(IP+) U$17.P$2(IP+) U$23.P$1(IP+) U$23.P$2(IP+) U$29.P$1(IP+) U$29.P$2(IP+) U$32.P$2(C) U$33.P$2(C) U$34.P$2(C) U$38.P$2(C) U$39.P$1(IP+) U$39.P$2(IP+) V-THRUST_OUT.P$1
VDD: C72.+ C76.+ Q1.3(D) R47.2 R48.2 U2.5(IN) U2.6(IN) U2.7(SHDN) U3.5(IN) U3.6(IN) U3.7(SHDN)
WATER: IC1.1(I0) SK_DISABLE1.2
Unconnected: 5V_CURR_ADC.P$2(ALERT) 5V_REG.16(TR/SS) 5V_REG.17(SYNC/MODE) 12V_CURR_ADC.P$2(ALERT) 12V_REG.16(TR/SS) 12V_REG.17(SYNC/MODE) U1.15(CH8) U1.16(CH9) U1.17(CH10) U1.18(CH11) U1.19(CH12) U1.20(CH13) U1.21(CH14) U1.22(CH15) U$3.1-8(PA5) U$3.2-2(PB2) U$3.2-4(PF0) U$3.2-8(PA4) U$3.2-9(PA3) U$3.2-10(PA2) U$3.3-3(PB6) U$3.3-4(PB7) U$3.3-10(PF1) U$3.4-1(PF2) U$3.4-2(PF3) U$3.4-3(PB3) U$3.4-4(PC4) U$3.4-5(PC5) U$3.4-6(PC6) U$3.4-7(PC7) U$3.4-8(PD6) U$3.4-9(PD7) U$3.4-10(PF4) V-THRUST_CURR_ADC.P$2(ALERT)

## Notes on the sheet
- Address: 1110111 (0x77)(BME)
- PG is an open-drain fault pin.
- Off Switch | On Switch | On Indicator
- Address: 1010101 (12V ADC)
- Address: 1110111 (0x77) )(BAR30)
- 5V LDO | 10V LDO | Secondary AND Gate
- Address: 1011010 (VIN ADC)
- Power Switching | Main Gate Control | Water Sensor Amplifier
- Should these be 5V powered?
- PG is an open-drain fault pin.
- Address: 1011001 (5V ADC)
- 5V Regulator "Power Good"?
- Address: 1001000 (Thrust ADC)

## Power pins joined to a net without a drawn wire
GND: IC1.3(GND) IC4.3(GND)
VCC: IC1.5(VCC) IC4.5(VCC)

## Library data of the parts
3V3_LED 5V_LED 12V_LED BATTERY_LED RELAY-OUT_LED SHORE_LED V-THRUST_LED = led:0805_LED: LED, 0805 package. Any variety.
5V_CURR_ADC 12V_CURR_ADC V-THRUST_CURR_ADC = texas:ADC121C021: ADC121C021 8-pin VSSOP package 1 channel, 12-bit I2C ADC Datasheet <http://www.ti.com/lit/ds/symlink/adc121c021.pdf>
5V_OUT 12V_OUT CAMERA1 CAMERA2 CPU_ON ETHERNET FAN1 FAN2 V-THRUST_OUT = molex:KK254_VERT_2PIN: KK® 254 Wire-to-Board Header, Vertical, with Friction Lock, 2 Circuits, Gold (Au) Plating Part Number: 22-29-2021 http://www.molex.com/molex/products/datasheet.jsp?part=active/0022292021_PCB_HEADERS.xml
5V_PG LED2 ON_INDICATOR = led:LED: LED OSRAM: - CHIPLED LG R971, LG N971, LY N971, LG Q971, LY Q971, LO R971, LY R971 LH N974, LH R974 LS Q976, LO Q976, LY Q976 LO Q996 - Hyper CHIPLED LW Q18S LB Q993, LB Q99A, LB R99A - SideLED LS A670, LO A670, LY A670, LG A670, LP A670 LB A673, LV A673, LT A673, LW A673 LH A674 LY A675 LS A676, LA A676, LO A676, LY A676, LW A676 LS A679, LY A679, LG A679 - Hyper Micro SIDELED® LS Y876, LA Y876, LO Y876, LY Y876 LT Y87S - SmartLED LW L88C, LW L88S LB L89C, LB L89S, LG L890 LS L89K, LO L89K, LY L89K LS L896, LA L896, LO L896, LY L896 - TOPLED LS T670, LO T670, LY T670, LG T670, LP T670 LSG T670, LSP T670, LSY T670, LOP T670, LYG T670 LG T671, LOG T671, LSG T671 LB T673, LV T673, LT T673, LW T673 LH T674 LS T676, LA T676, LO T676, LY T676, LB T676, LH T676, LSB T676, LW T676 LB T67C, LV T67C, LT T67C, LS T67K, LO T67K, LY T67K, LW E67C LS E67B, LA E67B, LO E67B, LY E67B, LB E67C, LV E67C, LT E67C LW T67C LS T679, LY T679, LG T679 LS T770, LO T770, LY T770, LG T770, LP T770 LB T773, LV T773, LT T773, LW T773 LH T774 LS E675, LA E675, LY E675, LS T675 LS T776, LA T776, LO T776, LY T776, LB T776 LHGB T686 LT T68C, LB T68C - Hyper Mini TOPLED® LB M676 - Mini TOPLED Santana® LG M470 LS M47K, LO M47K, LY M47K Source: http://www.osram.convergy.de LUXEON: - LUMILED® LXK2-PW12-R00, LXK2-PW12-S00, LXK2-PW14-U00, LXK2-PW14-V00 LXK2-PM12-R00, LXK2-PM12-S00, LXK2-PM14-U00 LXK2-PE12-Q00, LXK2-PE12-R00, LXK2-PE12-S00, LXK2-PE14-T00, LXK2-PE14-U00 LXK2-PB12-K00, LXK2-PB12-L00, LXK2-PB12-M00, LXK2-PB14-N00, LXK2-PB14-P00, LXK2-PB14-Q00 LXK2-PR12-L00, LXK2-PR12-M00, LXK2-PR14-Q00, LXK2-PR14-R00 LXK2-PD12-Q00, LXK2-PD12-R00, LXK2-PD12-S00 LXK2-PH12-R00, LXK2-PH12-S00 LXK2-PL12-P00, LXK2-PL12-Q00, LXK2-PL12-R00 Source: www.luxeon.com KINGBRIGHT: KA-3528ASYC Source: www.kingbright.com
5V_REG 12V_REG = linear:LT8640: Linear LT8640 Buck converter Datasheet <https://cds.linear.com/docs/en/datasheet/8640fa.pdf>
5V_VOLTAGE 12V_VOLTAGE V-THRUST_VOLAGE = texas:INA219: TI INA219 Voltage/Current/Power monitor with I2C Datasheet <http://www.ti.com/lit/ds/symlink/ina219.pdf>
BATTERY_IN SHORE_IN = molex:2_SUPERSABRE: Molex SuperSabre 2-pin vertical header
BME280 = BME280ComponentLibrary:BME280; PROD_ID: IC-13090
C1-C35 C37-C58 C60 C61 C63-C71 C73-C75 = resistor:C-US: CAPACITOR, American symbol
C36 C59 C62 C72 C76 = resistor:CPOL-US: POLARIZED CAPACITOR, American symbol
CPU_PWR DEPTH_SENS THRUST1-THRUST8 = molex:KK254_VERT_4PIN: KK® 254 Wire-to-Board Header, Vertical, with Friction Lock, 4 Circuits, Gold (Au) Plating Part Number: 22-29-2041 http://www.molex.com/molex/products/datasheet.jsp?part=active/0022292041_PCB_HEADERS.xml
D1 = diode:DIODE-: DIODE
FAULT1 FAULT2 OFF_SW ON_SW T_FUSE WATER = pinhead:PINHD-1X2: PIN HEADER
FAULT1_DISABLE SK_DISABLE SK_DISABLE1 TH_DISABLE = jumper:JP1E: JUMPER
I2C_SHIFT = texas:PCA9306: TI I2C/SMBus Level Shifter Bidirectional 5V <-> 3V3 Datasheet <http://www.ti.com/lit/ds/symlink/pca9306.pdf>
IC1 IC3 IC4 = 74xx-little-us:74*1G08: 2-input AND gate
IC2 = texas:TLC2272
L1 L2 = resistor:L-US: INDUCTOR, American symbol
N1 = transistor-fet:2N7002
OFF ON = switch-tact:DTS-6
Q1 = transistor-fet:FDN5618P
R1-R3 R7 R8 R10-R12 R14-R27 R29-R58 R60 R61 = resistor:R-US_: RESISTOR, American symbol
R59 = resistor:R-TRIMM: Trimm resistor
SHORE-FET U$61 = transistor-power:IPD50P04P4-13: Infineon IPD50P04P4-13 OptiMOS®-P2 Power-Transistor Datasheet <http://www.mouser.com/ds/2/196/Infineon-IPD50P04P4-13-DS-v01_02-EN-336147.pdf>
THRUSTER_CURR_ADC = texas:ADS7828: Texas Instruments ADS7828 8-channel 12-bit I2C ADC Datasheet <http://www.ti.com/lit/ds/symlink/ads7828.pdf>
U1 = NXP:PCA9685: 16-channel 12-bit PWM I2C interface Internal Oscillator 40Hz to 1kHz Can be totem pole or open collector 2.3V to 5.5V; PROD_ID: IC-12240
U2 U3 = linear:LT3063
U$1 U$66 = transistor-fet:DMP32D5SFB: Diodes Inc. DMP32D5SFB 30V P-MOSFET (Enhancement) Datasheet <http://www.mouser.com/ds/2/115/DMP32D5SFB-765036.pdf>
U$2 U$4 U$8 U$11 U$14 U$17 U$19 U$23 U$29 U$35 U$39 = allegro:ACS713
U$3 = texas:TIVA-C_EVAL: Texas Instruments Tiva-C TM4C123G LaunchPad Evaluation Board Part number EK-TM4C123GXL Datasheet <http://www.ti.com/lit/ug/spmu296/spmu296.pdf> Microcontroller <http://www.ti.com/lit/ds/spms376e/spms376e.pdf>
U$5 = littelfuse:BOWED-1.25"-FUSECLIPS: Littelfuse 1.25" fuse clips with bowed leads
U$6 U$9 U$12 U$15 U$18 U$20 U$27 U$36 U$37 U$40 = littelfuse:154-OMNI_BLOK: Littelfuse NANO2 Series 154 Omni-Blok fuseholder Datasheet <http://www.mouser.com/ds/2/240/Littelfuse_Fuse_154_154T_154L_154TL_Datasheet.pdf-309941.pdf>
U$10 U$13 U$16 U$22 U$26 U$28 U$30-U$34 U$38 U$50 U$57 U$59 U$60 = diode:VTVS: Vishay VTVS5V0ASMF to VTVS63GSMF 400W TVS diodes Datasheet <http://www.mouser.com/ds/2/427/vtvs5v0asmf-1078013.pdf>
U$25 = TE:KUHP-5XX1-XX: TE Connectivity KUHP-Series Relay Panel relays with quick-connect terminals Relay Datasheet <http://www.mouser.com/ds/2/418/NG_DS_1308242_KUHP_0914_KUHP_0914-713261.pdf> IMPORTANT NOTE: This part is designed using female PCB-mount spade terminals. Part: Keystone Electronics 0.25"x0.032" PC quick-fit terminals (Part No. 3528). Datasheet <http://www.mouser.com/ds/2/215/528-745365.pdf>
U$45 = NXP:74LVC1G14: Nexperia 74LVC1G14 Single Schmitt trigger inverter Datasheet <http://www.mouser.com/ds/2/302/74LVC1G14_Q100-839654.pdf>
U$46-U$49 = diode:ESD9X3: ON Semiconductors TVS Diodes ESD9X3.3ST5G Series, SZESD9X3.3ST5G Series Datasheet <http://www.mouser.com/ds/2/308/ESD9X3.3ST5G-D-241605.pdf>
U$51-U$54 U$64 U$65 = diode:DESD: Diodes Inc. Low Cap. Bidirectional TVS Diodes Datasheet <http://www.mouser.com/ds/2/115/ds31434-219410.pdf>
U$62 U$63 = switches:GPTS203212B: CW Industries Pushbutton SPST switch ON-OFF, 1A, 30VDC Datasheet <http://switches-connectors-custom.cwind.com/Asset/GPTS203211BR2.pdf>